# EasyEDA schematic EasyEDA_Source.json
TITLE: Meadow CCM Add-on Module - Debug Headers; REV: v1.d; Date: 2022.03; Sheet: 1/1; Drawn By: bryan costanich; Company: Wilderness Labs
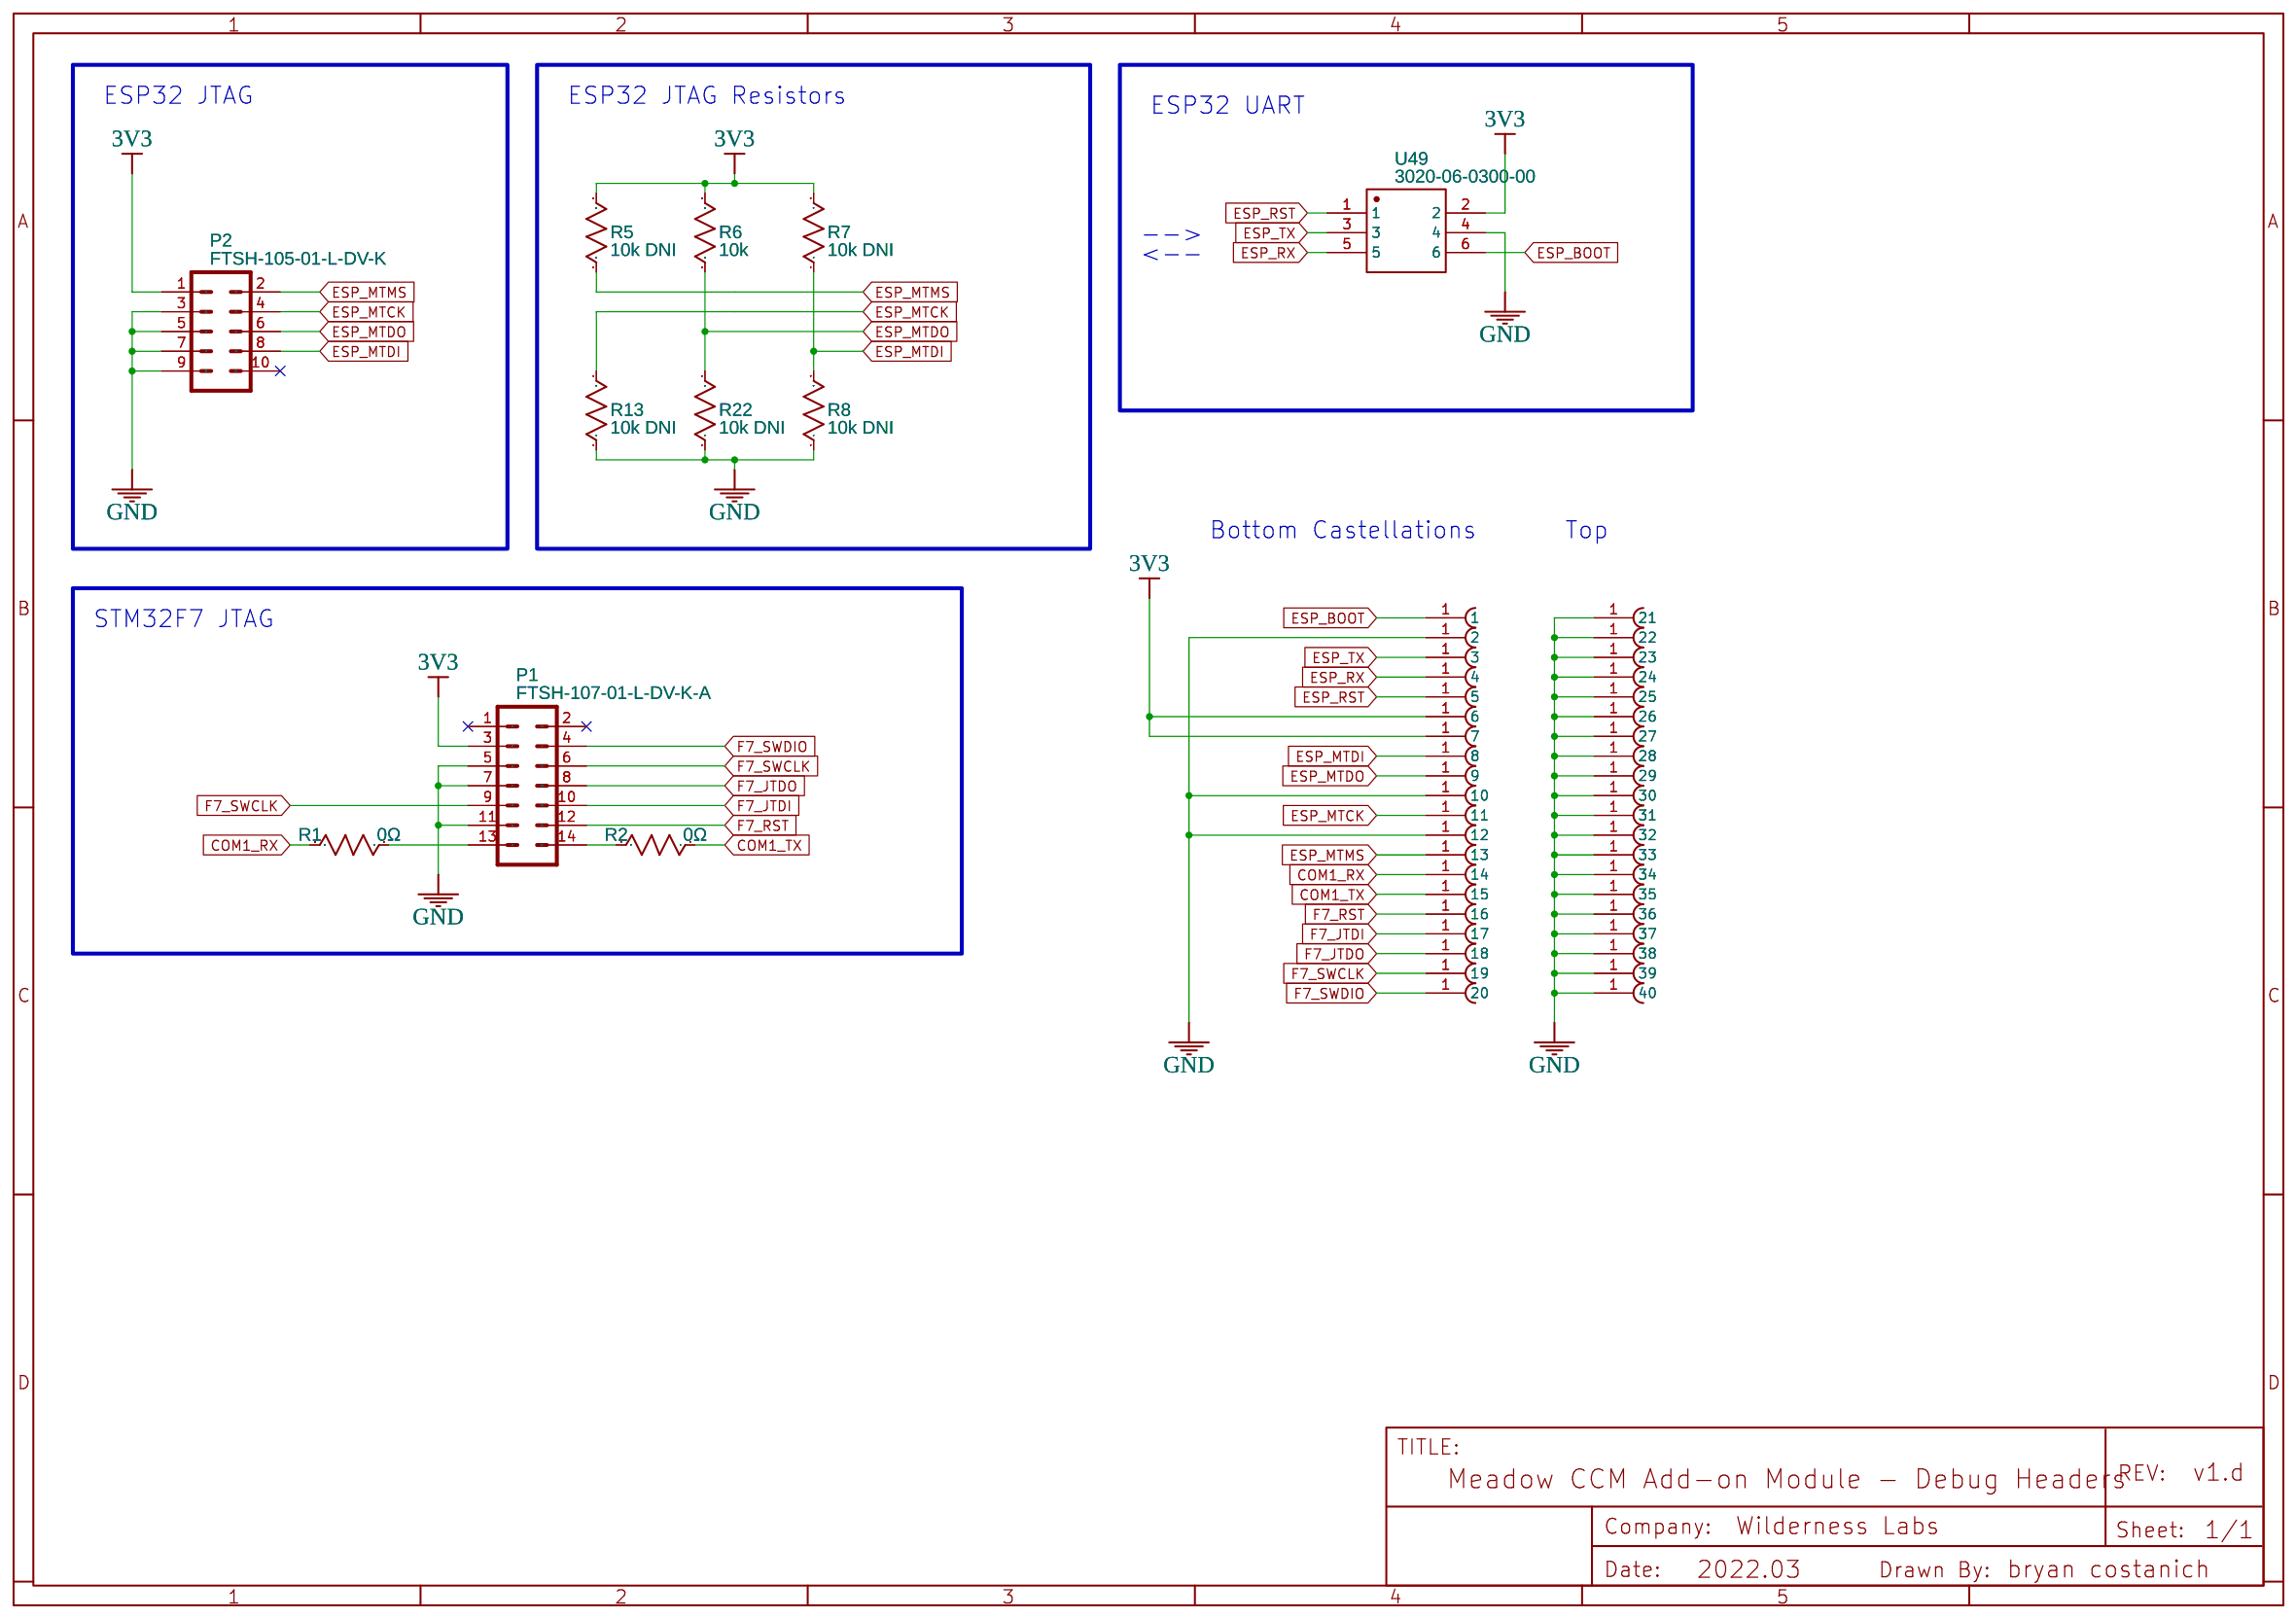
[diagram p0: schematic sheet]

## Parts
P1  FTSH-107-01-L-DV-K-A  [FTSH-107-01-L-DV-K-A]
P2  FTSH-105-01-L-DV-K  [FTSH-105-01-L-DV-K]
R1  0Ω  [R0603]
R2  0Ω  [R0603]
R5  10k DNI  [R0603]
R6  10k  [R0603]
R7  10k DNI  [R0603]
R8  10k DNI  [R0603]
R13  10k DNI  [R0603]
R22  10k DNI  [R0603]
U1  1.2MM SMT Castellation  [1.2MM SMT CASTELLATION]
U2  1.2MM SMT Castellation  [1.2MM SMT CASTELLATION]
U3  1.2MM SMT Castellation  [1.2MM SMT CASTELLATION]
U4  1.2MM SMT Castellation  [1.2MM SMT CASTELLATION]
U5  1.2MM SMT Castellation  [1.2MM SMT CASTELLATION]
U6  1.2MM SMT Castellation  [1.2MM SMT CASTELLATION]
U7  1.2MM SMT Castellation  [1.2MM SMT CASTELLATION]
U8  1.2MM SMT Castellation  [1.2MM SMT CASTELLATION]
U9  1.2MM SMT Castellation  [1.2MM SMT CASTELLATION]
U10  1.2MM SMT Castellation  [1.2MM SMT CASTELLATION]
U11  1.2MM SMT Castellation  [1.2MM SMT CASTELLATION]
U12  1.2MM SMT Castellation  [1.2MM SMT CASTELLATION]
U13  1.2MM SMT Castellation  [1.2MM SMT CASTELLATION]
U14  1.2MM SMT Castellation  [1.2MM SMT CASTELLATION]
U15  1.2MM SMT Castellation  [1.2MM SMT CASTELLATION]
U16  1.2MM SMT Castellation  [1.2MM SMT CASTELLATION]
U17  1.2MM SMT Castellation  [1.2MM SMT CASTELLATION]
U18  1.2MM SMT Castellation  [1.2MM SMT CASTELLATION]
U19  1.2MM SMT Castellation  [1.2MM SMT CASTELLATION]
U20  1.2MM SMT Castellation  [1.2MM SMT CASTELLATION]
U21  1.2MM SMT Castellation  [1.2MM SMT CASTELLATION]
U22  1.2MM SMT Castellation  [1.2MM SMT CASTELLATION]
U23  1.2MM SMT Castellation  [1.2MM SMT CASTELLATION]
U24  1.2MM SMT Castellation  [1.2MM SMT CASTELLATION]
U25  1.2MM SMT Castellation  [1.2MM SMT CASTELLATION]
U26  1.2MM SMT Castellation  [1.2MM SMT CASTELLATION]
U27  1.2MM SMT Castellation  [1.2MM SMT CASTELLATION]
U28  1.2MM SMT Castellation  [1.2MM SMT CASTELLATION]
U29  1.2MM SMT Castellation  [1.2MM SMT CASTELLATION]
U30  1.2MM SMT Castellation  [1.2MM SMT CASTELLATION]
U31  1.2MM SMT Castellation  [1.2MM SMT CASTELLATION]
U32  1.2MM SMT Castellation  [1.2MM SMT CASTELLATION]
U33  1.2MM SMT Castellation  [1.2MM SMT CASTELLATION]
U34  1.2MM SMT Castellation  [1.2MM SMT CASTELLATION]
U35  1.2MM SMT Castellation  [1.2MM SMT CASTELLATION]
U36  1.2MM SMT Castellation  [1.2MM SMT CASTELLATION]
U37  1.2MM SMT Castellation  [1.2MM SMT CASTELLATION]
U38  1.2MM SMT Castellation  [1.2MM SMT CASTELLATION]
U39  1.2MM SMT Castellation  [1.2MM SMT CASTELLATION]
U49  3020-06-0300-00  [302006030000]
U53  1.2MM SMT Castellation  [1.2MM SMT CASTELLATION]

## Library data of the parts
P1 = FTSH-107-01-L-DV-K-A: FTSH Pin Header; sourceId: prlDVd7oG; Manufacturer: Samtec; Cost €: 2,25; Supplier Part No: SAM8910-ND; Link: http://www.digikey.de/product-detail/de/samtec-inc/FTSH-105-01-L-DV-P/SAM8910-ND/2649982
P2 = FTSH-105-01-L-DV-K: FTSH Pin Header; sourceId: prlDVd7oG; Manufacturer: Samtec; Supplier: Digi-Key; Cost €: 2,25; Supplier Part No: SAM8910-ND; Link: http://www.digikey.de/product-detail/de/samtec-inc/FTSH-105-01-L-DV-P/SAM8910-ND/2649982
R1 R2 = R_0603_US: Contributor: LCEDA_Lib; Manufacturer Part: RC0603JR-070RL; Manufacturer: Yageo
R5-R8 R13 R22 = R_0603_US: Contributor: LCEDA_Lib; Manufacturer Part: RC0603FR-0710KL; Manufacturer: Yageo
U1-U39 U53 = 1.2MM SMT Castellation: Contributor: bryan_6020
U49 = 3020-06-0300-00: Manufacturer: CNC Tech; Supplier Part: 1175-1864-ND; Contributor: bryan costanich

## Nets
3V3: P1.3 P2.1 R5.2 R6.2 R7.2 U6.1(6) U7.1(7) U49.2
GND: P1.5 P1.7 P1.11 P2.3 P2.5 P2.7 P2.9 R8.1 R13.1 R22.1 U1.1(2) U5.1(21) U10.1(10) U12.1(12) U17.1(22) U19.1(23) U20.1(24) U21.1(25) U22.1(26) U23.1(27) U24.1(28) U25.1(29) U26.1(30) U27.1(31) U28.1(32) U29.1(33) U31.1(34) U32.1(35) U33.1(36) U34.1(37) U37.1(38) U38.1(39) U39.1(40) U49.4
COM1_RX: R1.2 U14.1(14)
COM1_TX: R2.1 U15.1(15)
ESP_BOOT: U49.6 U53.1
ESP_MTCK: P2.4 R13.2 U11.1(11)
ESP_MTDI: P2.8 R7.1 R8.2 U8.1(8)
ESP_MTDO: P2.6 R6.1 R22.2 U9.1(9)
ESP_MTMS: P2.2 R5.1 U13.1(13)
ESP_RST: U4.1(5) U49.1
ESP_RX: U3.1(4) U49.5
ESP_TX: U2.1(3) U49.3
F7_JTDI: P1.10 U18.1(17)
F7_JTDO: P1.8 U30.1(18)
F7_RST: P1.12 U16.1(16)
F7_SWCLK: P1.6 P1.9 U35.1(19)
F7_SWDIO: P1.4 U36.1(20)
Net-(P1-13): P1.13 R1.1
Net-(P1-14): P1.14 R2.2

Not connected (* = marked no-connect by the designer): P1 1* 2*; P2 10*

## Notes on the sheet
- ESP32 JTAG
- ESP32 JTAG Resistors
- ESP32 UART
- -->
- <--
- Bottom Castellations
- Top
- STM32F7 JTAG
